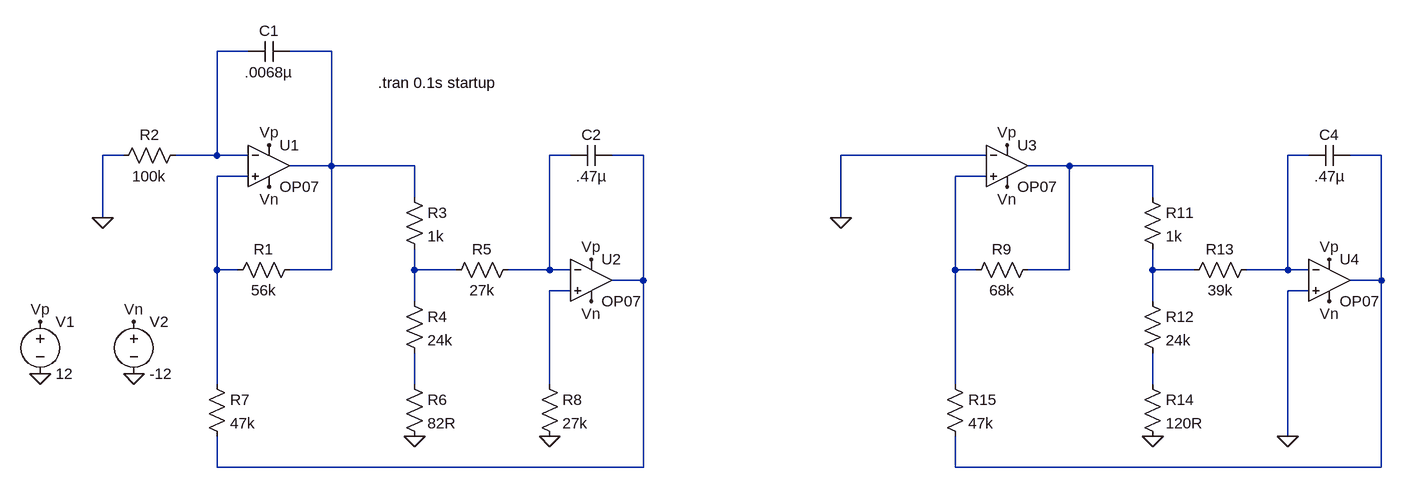
[diagram p0: schematic oscillator_fixed_comparison.asc]
oscillator_fixed_comparison.asc, the LTspice schematic file:
Version 4
SHEET 1 1864 804
WIRE 112 16 64 16
WIRE 240 16 176 16
WIRE -80 176 -112 176
WIRE 64 176 64 16
WIRE 64 176 0 176
WIRE 112 176 64 176
WIRE 608 176 576 176
WIRE 720 176 672 176
WIRE 1248 176 1024 176
WIRE 1744 176 1712 176
WIRE 1856 176 1808 176
WIRE 240 192 240 16
WIRE 240 192 176 192
WIRE 368 192 240 192
WIRE 1376 192 1312 192
WIRE 1504 192 1376 192
WIRE 112 208 64 208
WIRE 1248 208 1200 208
WIRE 368 240 368 192
WIRE 1504 240 1504 192
WIRE -112 272 -112 176
WIRE 1024 272 1024 176
WIRE 64 352 64 208
WIRE 96 352 64 352
WIRE 240 352 240 192
WIRE 240 352 176 352
WIRE 368 352 368 320
WIRE 432 352 368 352
WIRE 576 352 576 176
WIRE 576 352 512 352
WIRE 608 352 576 352
WIRE 1200 352 1200 208
WIRE 1232 352 1200 352
WIRE 1376 352 1376 192
WIRE 1376 352 1312 352
WIRE 1504 352 1504 320
WIRE 1568 352 1504 352
WIRE 1712 352 1712 176
WIRE 1712 352 1648 352
WIRE 1744 352 1712 352
WIRE 720 368 720 176
WIRE 720 368 672 368
WIRE 1856 368 1856 176
WIRE 1856 368 1808 368
WIRE 608 384 576 384
WIRE 1744 384 1712 384
WIRE 368 400 368 352
WIRE 1504 400 1504 352
WIRE 64 528 64 352
WIRE 368 528 368 480
WIRE 576 528 576 384
WIRE 1200 528 1200 352
WIRE 1504 528 1504 480
WIRE 1712 608 1712 384
WIRE 64 656 64 608
WIRE 720 656 720 368
WIRE 720 656 64 656
WIRE 1200 656 1200 608
WIRE 1856 656 1856 368
WIRE 1856 656 1200 656
FLAG -112 272 0
FLAG 368 608 0
FLAG 576 608 0
FLAG -208 432 Vp
FLAG 144 160 Vp
FLAG 640 336 Vp
FLAG -64 432 Vn
FLAG 144 224 Vn
FLAG 640 400 Vn
FLAG -64 512 0
FLAG -208 512 0
FLAG 1024 272 0
FLAG 1504 608 0
FLAG 1712 608 0
FLAG 1280 160 Vp
FLAG 1776 336 Vp
FLAG 1280 224 Vn
FLAG 1776 400 Vn
SYMBOL Opamps\\OP07 144 128 R0
SYMATTR InstName U1
SYMBOL cap 176 0 R90
WINDOW 0 0 32 VBottom 2
WINDOW 3 32 32 VTop 2
SYMATTR InstName C1
SYMATTR Value .0068µ
SYMBOL res 192 336 R90
WINDOW 0 0 56 VBottom 2
WINDOW 3 32 56 VTop 2
SYMATTR InstName R1
SYMATTR Value 56k
SYMBOL res 16 160 R90
WINDOW 0 0 56 VBottom 2
WINDOW 3 32 56 VTop 2
SYMATTR InstName R2
SYMATTR Value 100k
SYMBOL res 352 224 R0
SYMATTR InstName R3
SYMATTR Value 1k
SYMBOL res 352 384 R0
SYMATTR InstName R4
SYMATTR Value 24k
SYMBOL res 528 336 R90
WINDOW 0 0 56 VBottom 2
WINDOW 3 32 56 VTop 2
SYMATTR InstName R5
SYMATTR Value 27k
SYMBOL res 352 512 R0
SYMATTR InstName R6
SYMATTR Value 82R
SYMBOL Opamps\\OP07 640 304 R0
SYMATTR InstName U2
SYMBOL cap 672 160 R90
WINDOW 0 0 32 VBottom 2
WINDOW 3 32 32 VTop 2
SYMATTR InstName C2
SYMATTR Value .47µ
SYMBOL res 48 512 R0
SYMATTR InstName R7
SYMATTR Value 47k
SYMBOL res 560 512 R0
SYMATTR InstName R8
SYMATTR Value 27k
SYMBOL voltage -208 416 R0
WINDOW 123 0 0 Left 0
WINDOW 39 0 0 Left 0
SYMATTR InstName V1
SYMATTR Value 12
SYMBOL voltage -64 416 R0
SYMATTR InstName V2
SYMATTR Value -12
SYMBOL Opamps\\OP07 1280 128 R0
SYMATTR InstName U3
SYMBOL res 1328 336 R90
WINDOW 0 0 56 VBottom 2
WINDOW 3 32 56 VTop 2
SYMATTR InstName R9
SYMATTR Value 68k
SYMBOL res 1488 224 R0
SYMATTR InstName R11
SYMATTR Value 1k
SYMBOL res 1488 384 R0
SYMATTR InstName R12
SYMATTR Value 24k
SYMBOL res 1664 336 R90
WINDOW 0 0 56 VBottom 2
WINDOW 3 32 56 VTop 2
SYMATTR InstName R13
SYMATTR Value 39k
SYMBOL res 1488 512 R0
SYMATTR InstName R14
SYMATTR Value 120R
SYMBOL Opamps\\OP07 1776 304 R0
SYMATTR InstName U4
SYMBOL cap 1808 160 R90
WINDOW 0 0 32 VBottom 2
WINDOW 3 32 32 VTop 2
SYMATTR InstName C4
SYMATTR Value .47µ
SYMBOL res 1184 512 R0
SYMATTR InstName R15
SYMATTR Value 47k
TEXT 312 64 Left 2 !.tran 0.1s startup

The netlist it stands for:
* oscillator_fixed_comparison.asc
XU1 N008 N001 Vp Vn N002 LT1001  ; OP07, pins In+ In- V+ V- OUT
C1 N002 N001 .0068µ
R1 N002 N008 56k
R2 N001 0 100k
R3 N002 N010 1k
R4 N010 N013 24k
R5 N003 N010 27k
R6 N013 0 82R
XU2 N012 N003 Vp Vn N004 LT1001  ; OP07, pins In+ In- V+ V- OUT
C2 N004 N003 .47µ
R7 N008 N004 47k
R8 N012 0 27k
V1 Vp 0 12
V2 Vn 0 -12
XU3 N009 0 Vp Vn N007 LT1001  ; OP07, pins In+ In- V+ V- OUT
R9 N007 N009 68k
R11 N007 N011 1k
R12 N011 N014 24k
R13 N005 N011 39k
R14 N014 0 120R
XU4 0 N005 Vp Vn N006 LT1001  ; OP07, pins In+ In- V+ V- OUT
C4 N006 N005 .47µ
R15 N009 N006 47k
.tran 0.1s startup
.lib LTC.lib
.backanno
.end

* Results of the author's LTspice run, read from the files saved beside the schematic
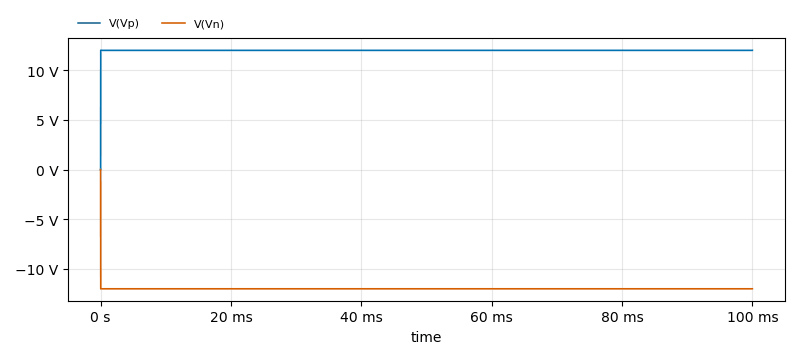
[diagram p1: Transient Analysis of oscillator_fixed_comparison.asc, plotted from the saved traces]
* Transient Analysis, 1 run:
*   V(Vp): min 0 V, max 12 V, average 12 V, rms 12 V, last 12 V
*   V(Vn): min -12 V, max 0 V, average -12 V, rms 12 V, last -12 V